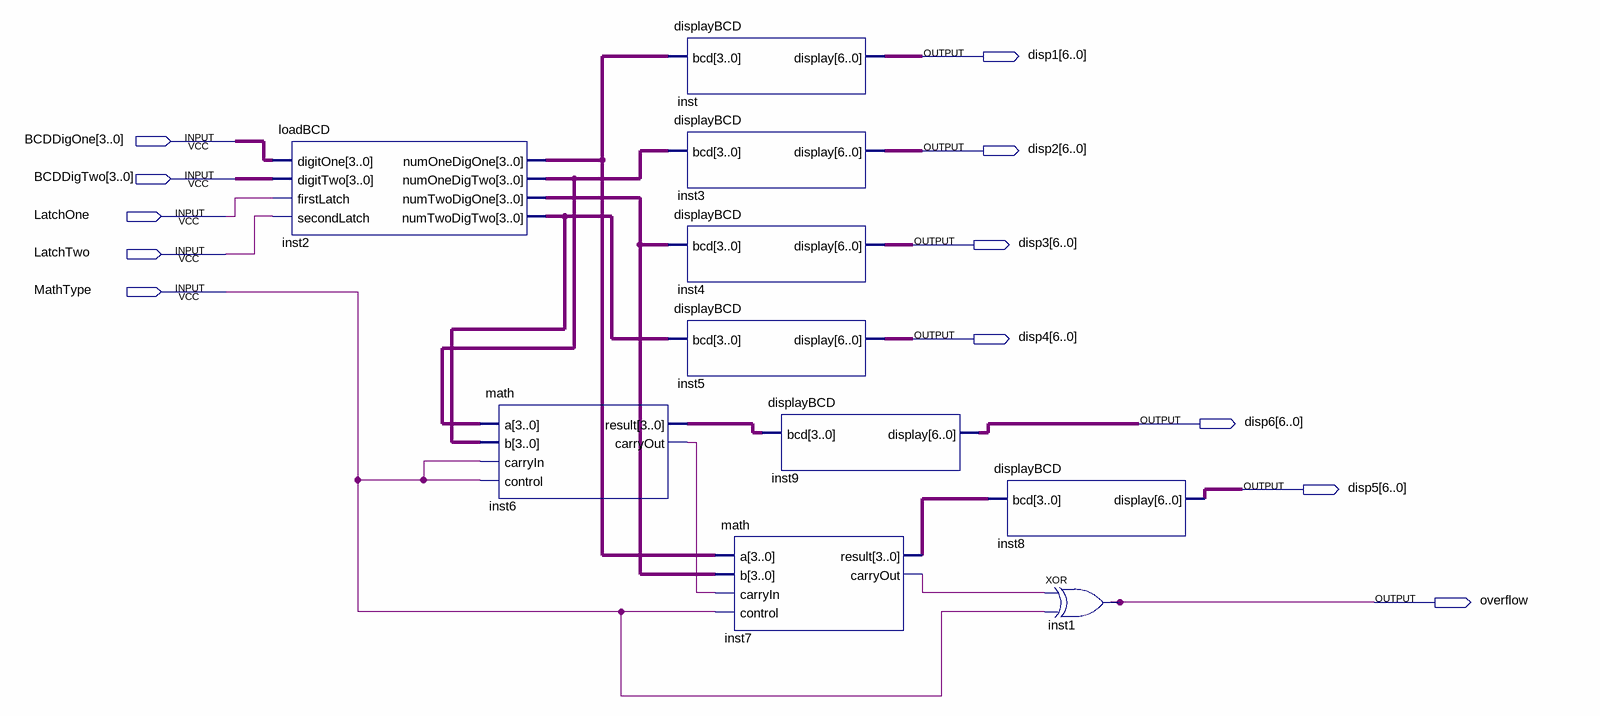
[diagram p0: schematic sheet]
// Quartus schematic BCDMath.bdf as structural Verilog: 10 symbols, 12 pins
module BCDMath (
  input  [3:0] BCDDigOne,
  input  [3:0] BCDDigTwo,
  input  LatchOne,
  input  LatchTwo,
  input  MathType,
  output [6:0] disp1,
  output [6:0] disp2,
  output [6:0] disp3,
  output [6:0] disp4,
  output [6:0] disp6,
  output [6:0] disp5,
  output overflow
);

  wire inst6_carryout, inst7_carryout;
  wire [3:0] inst2_numonedigone, inst2_numonedigtwo, inst2_numtwodigone, inst2_numtwodigtwo, inst6_result,
       inst7_result;

  loadBCD inst2 (
    .digitOne(BCDDigOne), .digitTwo(BCDDigTwo), .firstLatch(LatchOne), .secondLatch(LatchTwo),
    .numOneDigOne(inst2_numonedigone), .numOneDigTwo(inst2_numonedigtwo), .numTwoDigOne(inst2_numtwodigone),
    .numTwoDigTwo(inst2_numtwodigtwo));
  math inst6 (
    .a(inst2_numonedigtwo), .b(inst2_numtwodigtwo), .carryIn(MathType), .control(MathType),
    .result(inst6_result), .carryOut(inst6_carryout));
  displayBCD inst (.bcd(inst2_numonedigone), .display(disp1));
  displayBCD inst3 (.bcd(inst2_numonedigtwo), .display(disp2));
  displayBCD inst4 (.bcd(inst2_numtwodigone), .display(disp3));
  displayBCD inst5 (.bcd(inst2_numtwodigtwo), .display(disp4));
  displayBCD inst9 (.bcd(inst6_result), .display(disp6));
  math inst7 (
    .a(inst2_numonedigone), .b(inst2_numtwodigone), .carryIn(inst6_carryout), .control(MathType),
    .result(inst7_result), .carryOut(inst7_carryout));
  displayBCD inst8 (.bcd(inst7_result), .display(disp5));
  xor inst1 (overflow, inst7_carryout, MathType);
endmodule
